# Altium schematic sheet 555-timer-schematic.SchDoc: 555 Timer Tutorial
size A; DrawnBy: Betsalel Williamson